# EAGLE design Jetson_TK1 (EAGLE 7.5.0)

## Sheet 1 of 2: Camera Connector The LM340MP-05 converts +5V to +3.3V
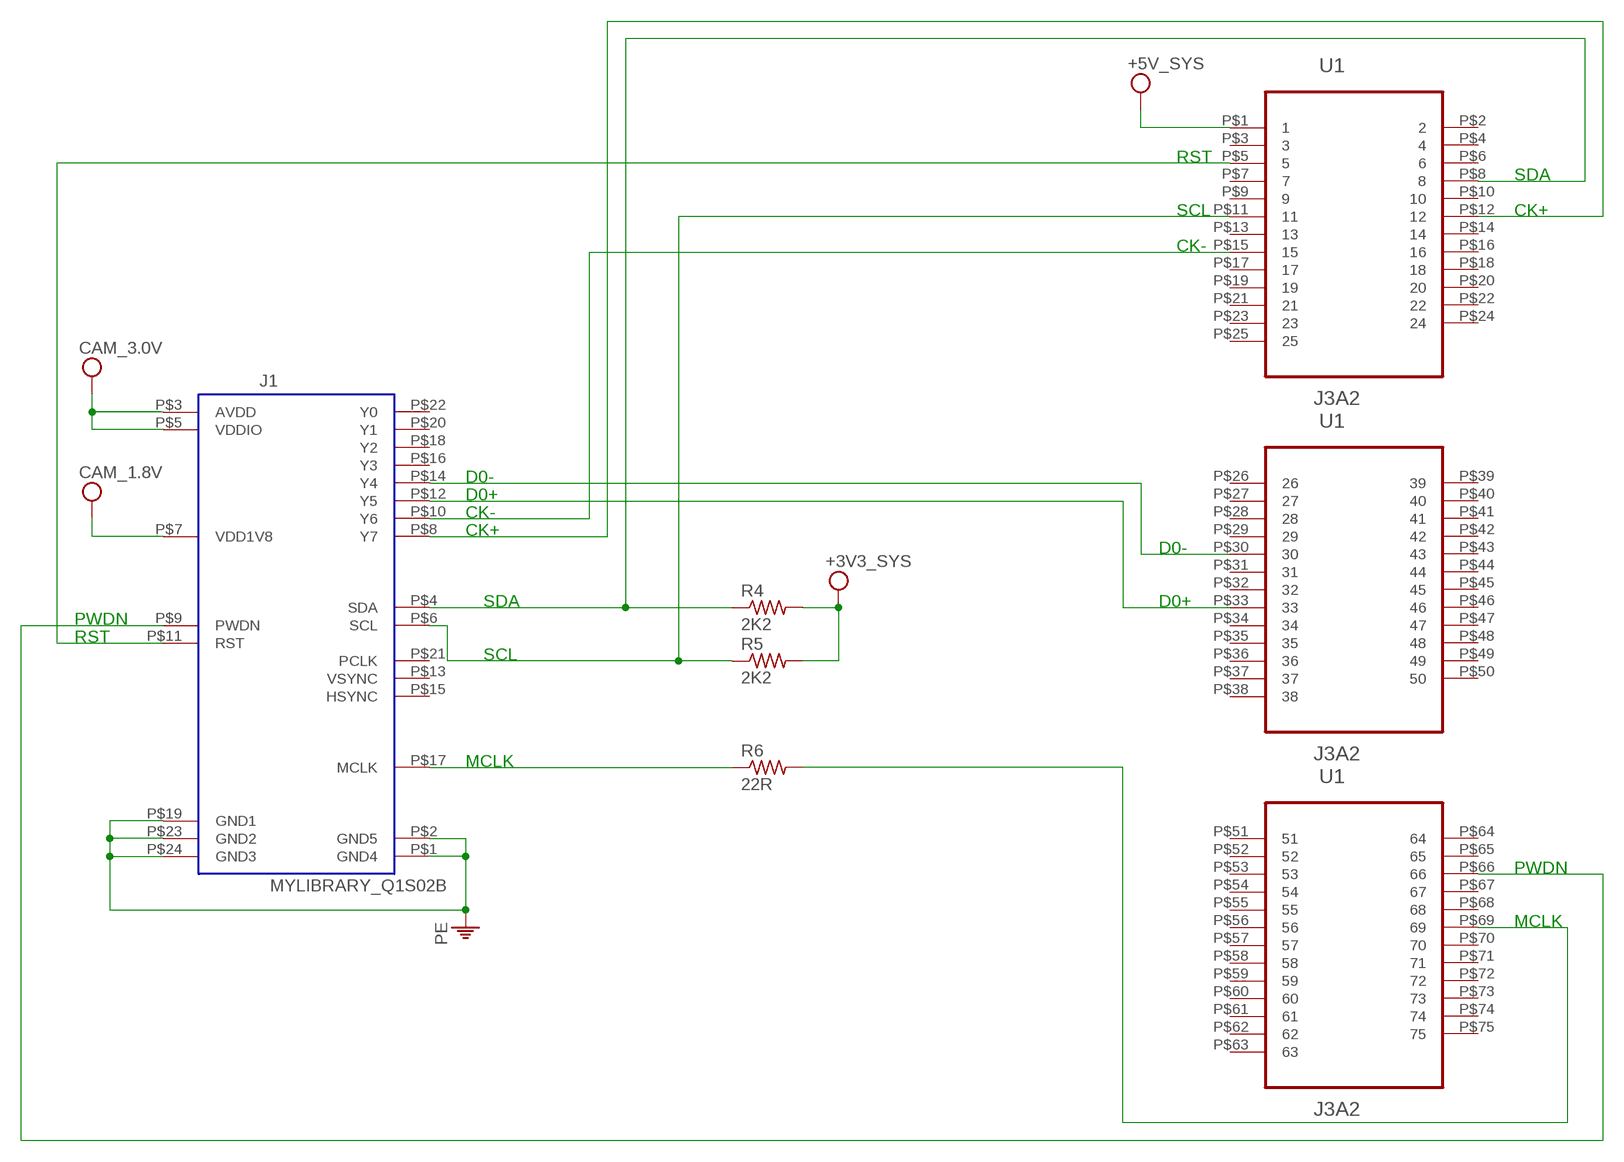
[diagram p0: schematic, sheet 1]

### Parts
J1  MYLIBRARY_Q1S02B  [MYLIBRARY_AXK824145WG]
R4  2K2  R-US_R0603  [R0603]
R5  2K2  R-US_R0603  [R0603]
R6  22R  R-US_R0603  [R0603]
U1  J3A2  [SQW-150-01-F-T]

### Nets
N$3: J1.P$8(Y7) U1.P$12
N$4: J1.P$4(SDA) R4.1 U1.P$8
N$5: J1.P$6(SCL) R5.1 U1.P$11
N$6: J1.P$10(Y6) U1.P$15
N$7: J1.P$12(Y5) U1.P$33
N$8: J1.P$14(Y4) U1.P$30
N$9: J1.P$17(MCLK) R6.1
N$10: R6.2 U1.P$69
N$11: J1.P$11(RST) U1.P$5
N$12: J1.P$9(PWDN) U1.P$66
PE: J1.P$1(GND4) J1.P$2(GND5) J1.P$19(GND1) J1.P$23(GND2) J1.P$24(GND3) ; also sheet 2
VDD: J1.P$3(AVDD) J1.P$5(VDDIO) J1.P$7(VDD1V8) R4.2 R5.2 U1.P$1 ; supply symbol labelled CAM_1.8V, CAM_3.0V, +5V_SYS, +3V3_SYS ; also sheet 2
Unconnected: J1.P$13(VSYNC) J1.P$15(HSYNC) J1.P$16(Y3) J1.P$18(Y2) J1.P$20(Y1) J1.P$21(PCLK) J1.P$22(Y0) U1.P$2 U1.P$3 U1.P$4 U1.P$6 U1.P$7 U1.P$9 U1.P$10 U1.P$13 U1.P$14 U1.P$16 U1.P$17 U1.P$18 U1.P$19 U1.P$20 U1.P$21 U1.P$22 U1.P$23 U1.P$24 U1.P$25 U1.P$26 U1.P$27 U1.P$28 U1.P$29 U1.P$31 U1.P$32 U1.P$34 U1.P$35 U1.P$36 U1.P$37 U1.P$38 U1.P$39 U1.P$40 U1.P$41 U1.P$42 U1.P$43 U1.P$44 U1.P$45 U1.P$46 U1.P$47 U1.P$48 U1.P$49 U1.P$50 U1.P$51 U1.P$52 U1.P$53 U1.P$54 U1.P$55 U1.P$56 U1.P$57 U1.P$58 U1.P$59 U1.P$60 U1.P$61 U1.P$62 U1.P$63 U1.P$64 U1.P$65 U1.P$67 U1.P$68 U1.P$70 U1.P$71 U1.P$72 U1.P$73 U1.P$74 U1.P$75

### Notes on the sheet
- RST
- SDA
- SCL | CK+
- CK-
- D0-
- D0+
- CK-
- CK+
- D0-
- SDA | D0+
- PWDN
- RST
- SCL
- MCLK
- PWDN
- MCLK

## Sheet 2 of 2: Camera Power Supply
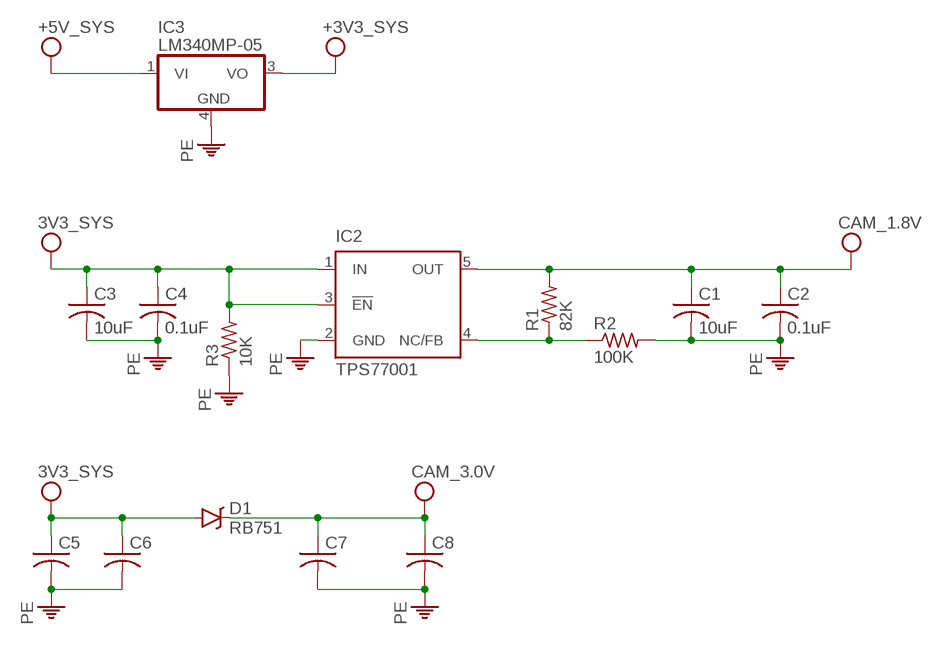
[diagram p1: schematic, sheet 2]

### Parts
C1  10uF  C-USC0603  [C0603]
C2  0.1uF  C-USC0603  [C0603]
C3  10uF  C-USC0603  [C0603]
C4  0.1uF  C-USC0603  [C0603]
C5  C-USC0603  [C0603]
C6  C-USC0603  [C0603]
C7  C-USC0603  [C0603]
C8  C-USC0603  [C0603]
D1  RB751  DIODE-SCHOTTKY-RB751  [SOD-523]
IC2  TPS77001  [SOT23-DBV]
IC3  LM340MP-05  [SOT223]
R1  82K  R-US_R0603  [R0603]
R2  100K  R-US_R0603  [R0603]
R3  10K  R-US_R0603  [R0603]

### Nets
N$2: IC2.4(NC/FB) R1.1 R2.1
PE: C1.2 C2.2 C3.2 C4.2 C5.2 C6.2 C7.2 C8.2 IC2.2(GND) IC3.4(GND) R2.2 R3.1 ; also sheet 1
VCC: C3.1 C4.1 C5.1 C6.1 D1.A IC2.1(IN) IC2.3(!EN) IC3.1(VI) IC3.3(VO) R3.2 ; supply symbol labelled 3V3_SYS, +5V_SYS, +3V3_SYS
VDD: C1.1 C2.1 C7.1 C8.1 D1.C IC2.5(OUT) R1.2 ; supply symbol labelled CAM_1.8V, CAM_3.0V ; also sheet 1

## Library data of the parts
C1-C8 = resistor:C-US: CAPACITOR, American symbol
D1 = SparkFun-DiscreteSemi:DIODE-SCHOTTKY: Schottky diodes in SFE's production catalog BAT20J 1A 23V 0.62Vf RB751 120mA 40V 0.37Vf PMEG4005EJ 0.5A 40V 0.42Vf MBRA140 1A 40V 0.5Vf B340A 3A 40V SMA; PROD_ID: DIO-11018
IC2 = texas:TPS770*: ULTRALOW-POWER 50-mA LOW-DROPOUT LINEAR REGULATORS 50-mA Low-Dropout Regulator Source: http://focus.ti.com/lit/ds/symlink/tps77001.pdf; MF: TEXAS INSTRUMENTS; MPN: TPS77001DBVT; OC_FARNELL: 8461554; OC_NEWARK: 77C1171
IC3 = linear:LM340?-*: Positive VOLTAGE REGULATOR Source: http://cache.national.com/ds/LM/LM340.pdf
J1 = pcDuino3c_MB:MYLIBRARY_Q1S02B
R1-R6 = resistor:R-US_: RESISTOR, American symbol
U1 = SQW-150-01-F-T:J3A2: SQW-150-01-F-T J3A2 Jetson TK1 GPIO Expansion Header 75 Pins - 3 Rows x 25 Pins

## Board
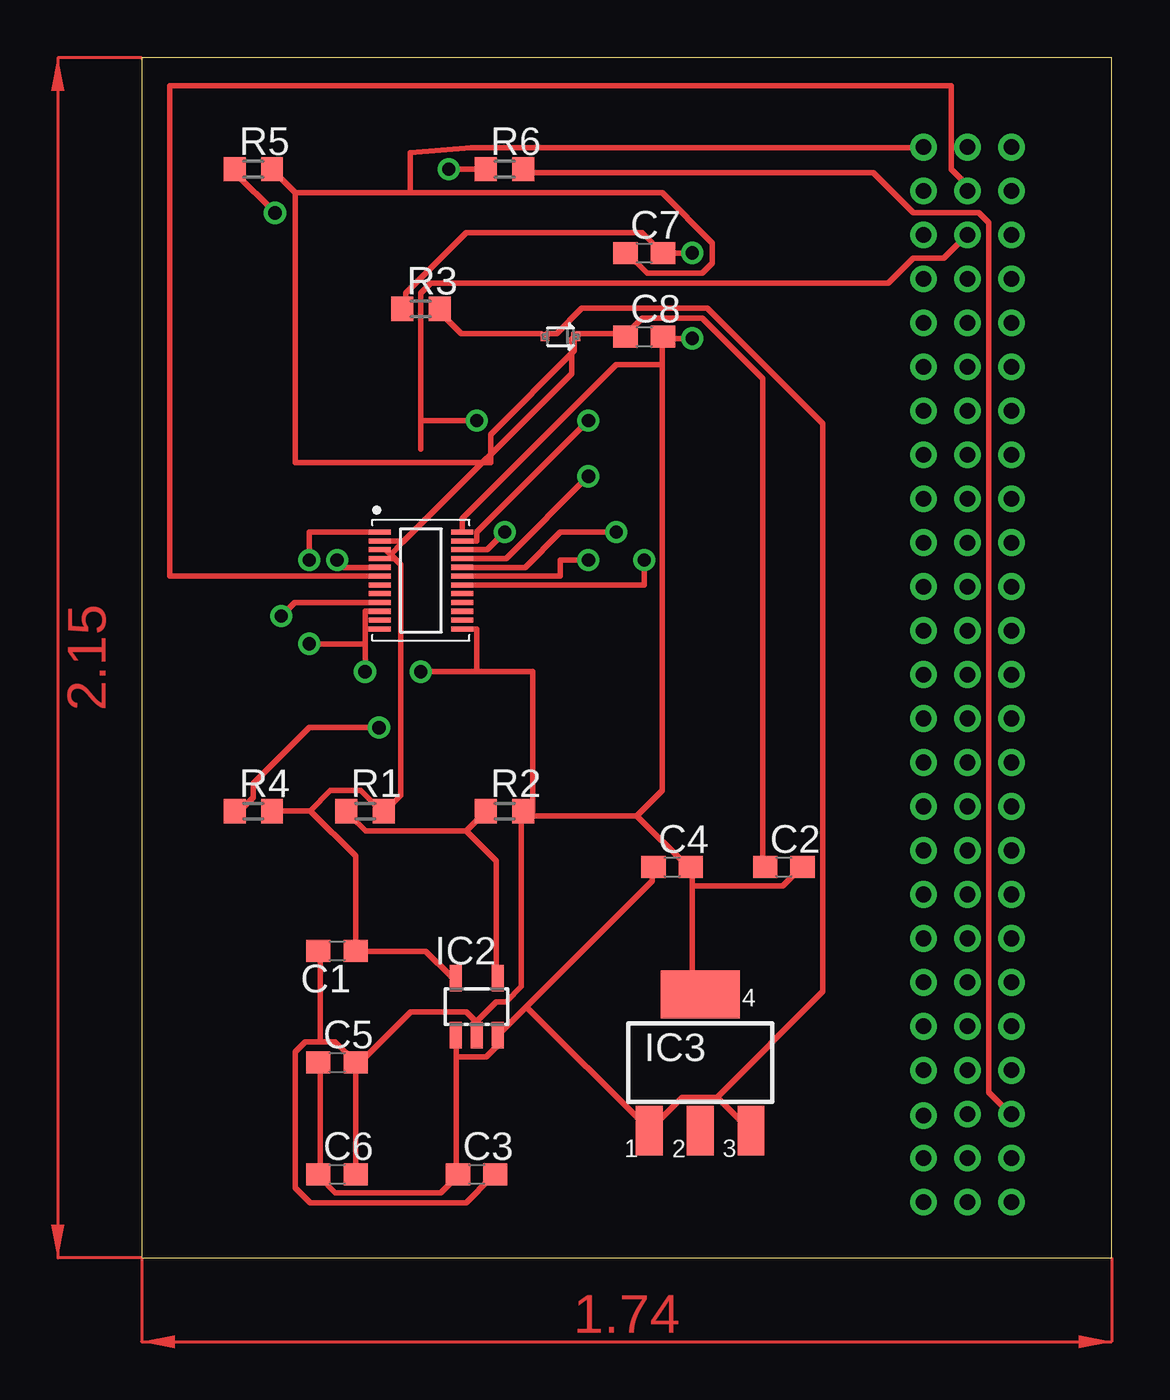
[diagram p2: board, top side]
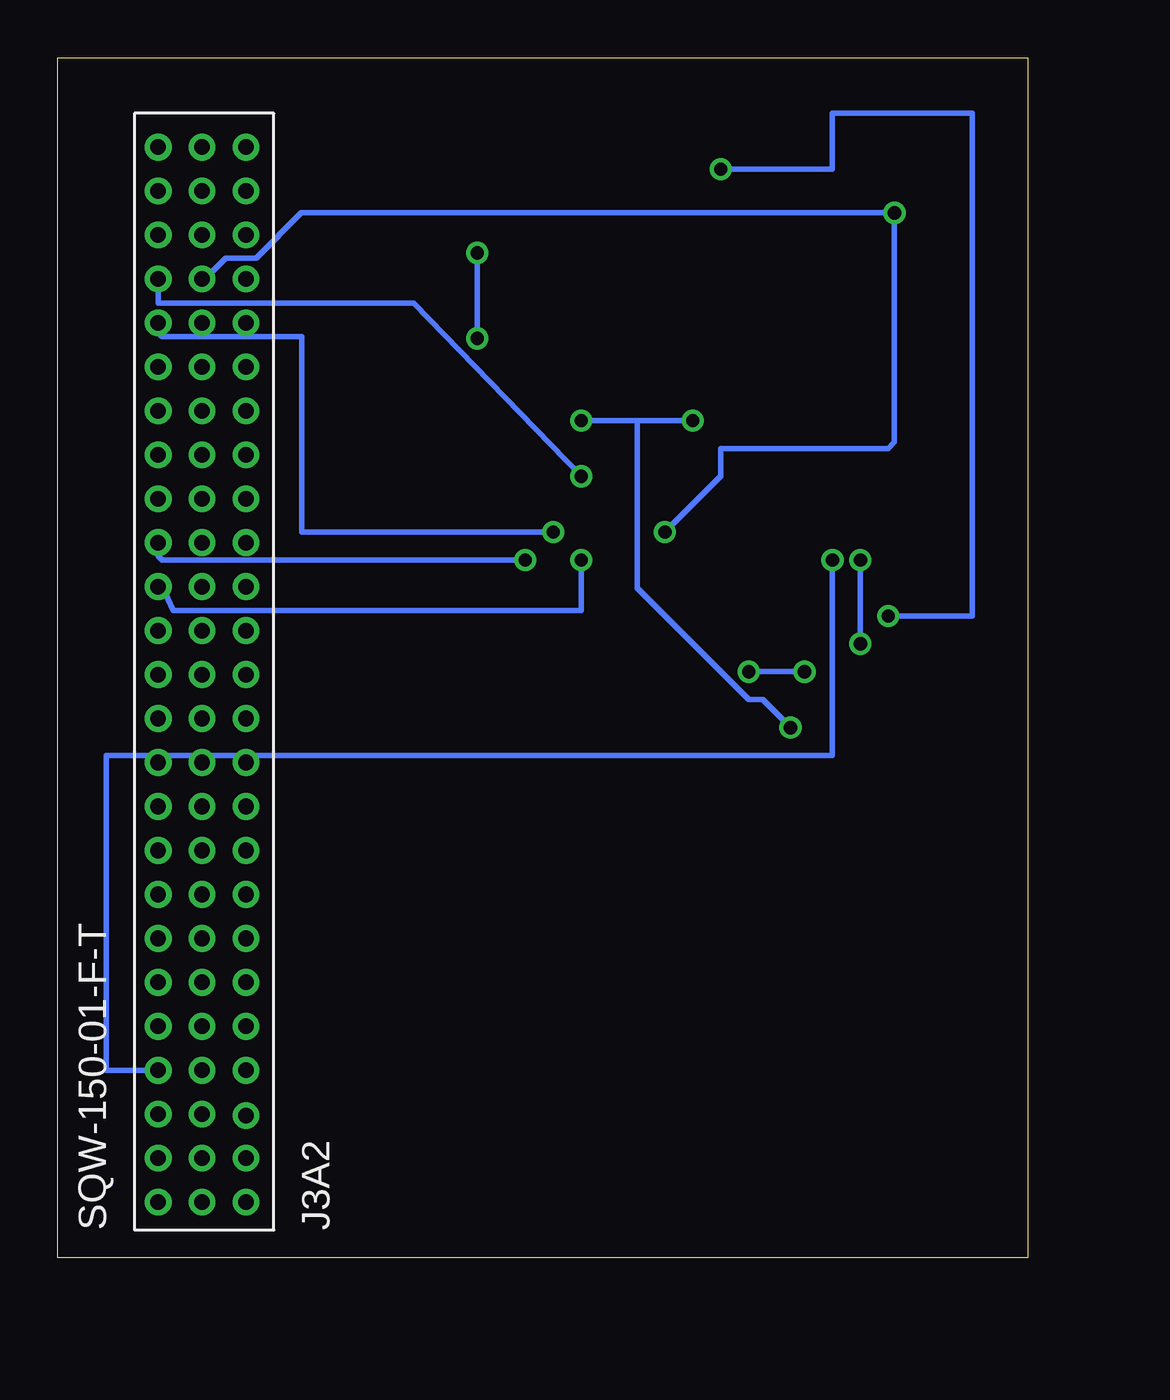
[diagram p3: board, bottom side, seen from below]

Size 44.12 x 54.6 mm. Coordinates in mm from the lower left corner, seen from the top.
Outline: 0,0 44.12,0 44.12,54.6 0,54.6 0,0
Copper layers (1*16): Top 0.035mm / dielectric 1.5mm / Bottom 0.035mm
Design rules "default": minimum track width 10mil, minimum drill 24mil, track to track 8mil, track to pad 8mil, pad to pad 8mil, via to via 8mil, smd to smd 8mil, copper to edge 40mil, drill to drill 8mil, minimum pad ring 10mil, minimum via ring 8mil, stop-mask expansion 4mil, vias tented up to drill 0mil, thermal gap 10mil

### Footprints (pad centres in the part's own frame; a part is rotated, then mirrored left to right if it is on the bottom)
C0603 = smd 1.1 x 1: 1 -0.85,0; 2 0.85,0
SOD-523 = smd 0.4 x 0.4: A -0.7,0; C 0.7,0
SOT23-DBV = smd 0.55 x 1.2: 1 -0.95,-1.3; 2 0,-1.3; 3 0.95,-1.3; 4 0.95,1.3; 5 -0.95,1.3
SOT223 = smd 1.219 x 2.235: 1 -2.311,-3.099; 2 0,-3.099; 3 2.311,-3.099 | smd 3.6 x 2.2: 4 0,3.099
MYLIBRARY_AXK824145WG = smd 0.23 x 1: P$1 0,-1.88; P$2 0,1.88; P$3 0.4,-1.88; P$4 0.4,1.88; P$5 0.8,-1.88; P$6 0.8,1.88; P$7 1.2,-1.88; P$8 1.2,1.88; P$9 1.6,-1.88; P$10 1.6,1.88; P$11 2,-1.88; P$12 2,1.88; P$13 2.4,-1.88; P$14 2.4,1.88; P$15 2.8,-1.88; P$16 2.8,1.88; P$17 3.2,-1.88; P$18 3.2,1.88; P$19 3.6,-1.88; P$20 3.6,1.88; P$21 4,-1.88; P$22 4,1.88; P$23 4.4,-1.88; P$24 4.4,1.88
R0603 = smd 1 x 1.1: 1 -0.85,0; 2 0.85,0
SQW-150-01-F-T = drill 0.711: P$1 48,0; P$2 48,2; P$3 48,4; P$4 46,0; P$5 46,2; P$6 46,4; P$7 44,0; P$8 44,2; P$9 44,4; P$10 42,0; P$11 42,2; P$12 42,4; P$13 40,0; P$14 40,2; P$15 40,4; P$16 38,0; P$17 38,2; P$18 38,4; P$19 36,0; P$20 36,2; P$21 36,4; P$22 34,0; P$23 34,2; P$24 34,4; P$25 32,0; P$26 32,2; P$27 32,4; P$28 30,0; P$29 30,2; P$30 30,4; P$31 28,0; P$32 28,2; P$33 28,4; P$34 26,0; P$35 26,2; P$36 26,4; P$37 24,0; P$38 24,2; P$39 24,4; P$40 22,0; P$41 22,2; P$42 22,4; P$43 20,0; P$44 20,2; P$45 20,4; P$46 18,0; P$47 18,2; P$48 18,4; P$49 16,0; P$50 16,2; P$51 16,4; P$52 14,0; P$53 14,2; P$54 14,4; P$55 12,0; P$56 12,2; P$57 12,4; P$58 10,0; P$59 10,2; P$60 10,4; P$61 8,0; P$62 8,2; P$63 8,4; P$64 5.999,0; P$65 6,2; P$66 6,4; P$67 3.932,0; P$68 4,2; P$69 4,4; P$70 2,0; P$71 2,2; P$72 2,4; P$73 0,0; P$74 0,2; P$75 0,4

### Placement (x,y rotation side)
C1  8.89,13.97 180 top
C2  29.21,17.78 0 top
C3  15.24,3.81 0 top
C4  24.13,17.78 0 top
C5  8.89,8.89 0 top
C6  8.89,3.81 0 top
C7  22.86,45.72 0 top
C8  22.86,41.91 0 top
D1  19.05,41.91 0 top
IC2  15.24,11.43 0 top
IC3  25.4,8.89 0 top
J1  12.7,33.02 270 top
R1  10.16,20.32 0 top
R2  16.51,20.32 0 top
R3  12.7,43.18 0 top
R4  5.08,20.32 0 top
R5  5.08,49.53 0 top
R6  16.51,49.53 0 top
U1  35.56,2.54 90 bottom

### Tracks (layer width: path | path; a pad name or v marks a point on that pad's centre or on a via)
N$2
  Top 0.254: 14.76,19.43 10.18,19.43 9.5,20.12 R1.1 | 14.76,19.43 15.44,20.12 R2.1 | 14.76,19.43 16.13,18.06 16.13,12.8 IC2.4
N$3  (via drill 0.6)
  Top 0.254: J1.P$8 16.58,31.82 v20.32,35.56
  Bottom 0.254: U1.P$12 39.56,43.43 27.94,43.43 v20.32,35.56
N$4  (via drill 0.6, 0.61)
  Top 0.254: 12.7,38.1 12.7,43.89 13.16,44.35 33.96,44.35 35.1,45.49 36.47,45.49 37.39,46.41 U1.P$8 | 12.7,38.1 12.7,36.8 | 4.24,20.34 R4.1 4.45,20.32 5.08,20.95 5.08,21.59 7.62,24.13 v10.79,24.13 | J1.P$4 15.24,32.62 15.24,33.02 v20.32,38.1 | 12.7,38.1 v15.24,38.1
  Bottom 0.254: v20.32,38.1 17.78,38.1 | 17.78,38.1 v15.24,38.1 | v10.79,24.13 12.06,25.4 12.7,25.4 17.78,30.48 17.78,38.1
N$5  (via drill 0.6, 0.61)
  Top 0.254: v6.07,47.55 4.24,49.38 R5.1 | J1.P$6 15.71,32.22 v16.51,33.02
  Bottom 0.254: U1.P$11 37.39,44.58 36.47,45.49 35.1,45.49 33.04,47.55 v6.07,47.55 6.07,37.11 6.35,36.83 13.97,36.83 13.97,35.56 v16.51,33.02
N$6  (via drill 0.6)
  Top 0.254: J1.P$10 17.45,31.42 19.05,33.02 v21.59,33.02
  Bottom 0.254: U1.P$15 39.56,42.1 39.37,41.91 33.02,41.91 33.02,33.02 v21.59,33.02
N$7  (via drill 0.6)
  Top 0.254: J1.P$12 19.05,31.02 19.05,31.75 v20.32,31.75
  Bottom 0.254: U1.P$33 39.37,30.54 38.86,29.46 20.32,29.46 v20.32,31.75
N$8  (via drill 0.6)
  Top 0.254: J1.P$14 22.86,30.62 v22.86,31.75
  Bottom 0.254: U1.P$30 39.56,31.94 39.37,31.75 v22.86,31.75
N$9  (via drill 0.6)
  Top 0.254: R6.1 v13.97,49.53 | J1.P$17 6.96,29.82 v6.35,29.21
  Bottom 0.254: v13.97,49.53 8.89,49.53 8.89,52.07 2.54,52.07 2.54,29.21 v6.35,29.21
N$10
  Top 0.254: R6.2 17.5,49.38 33.27,49.38 35.1,47.55 38.07,47.55 38.53,47.09 38.53,7.54 39.45,6.63 U1.P$69
N$11
  Top 0.254: U1.P$5 37.56,48.8 36.83,49.53 36.83,53.34 1.27,53.34 1.27,31.02 J1.P$11
N$12  (via drill 0.6)
  Top 0.254: J1.P$9 9.22,31.42 v8.89,31.75
  Bottom 0.254: U1.P$66 41.91,8.54 41.91,22.86 8.89,22.86 v8.89,31.75
PE  (via drill 0.6, 0.61)
  Top 0.254: C6.2 9.73,3.89 9.73,8.69 C5.2 | 8.13,9.83 8.81,9.83 9.73,8.91 C5.2 | 8.13,9.83 7.44,9.83 6.98,9.37 6.98,3.2 7.67,2.52 14.76,2.52 15.9,3.66 C3.2 | 8.13,9.83 8.13,13.95 C1.2 | 15.21,10.74 15.21,10.29 IC2.2 | 15.21,10.74 14.76,11.2 12.24,11.2 9.96,8.91 C5.2 | R3.1 12.01,43.2 12.01,43.89 14.76,46.63 22.76,46.63 23.67,45.72 C7.2 v25.04,45.72 | 25.04,16.92 25.04,12.34 25.27,12.12 IC3.4 | 25.04,16.92 25.04,17.6 C4.2 24.82,17.83 22.53,20.12 | 22.53,20.12 17.5,20.12 R2.2 | 25.04,16.92 29.16,16.92 29.84,17.6 C2.2 | 23.67,40.64 23.67,21.26 22.53,20.12 | 23.67,40.64 23.67,41.83 C8.2 23.9,41.83 v25.04,41.83 | 15.21,10.74 16.13,11.66 16.59,11.66 17.27,12.34 17.27,20.12 R2.2 | 10.16,28.62 10.16,29.42 J1.P$19 | J1.P$24 15.24,28.62 15.24,26.67 | 15.24,26.67 v12.7,26.67 | J1.P$23 10.16,28.62 | 10.16,28.62 10.16,27.94 | 10.16,27.94 v10.16,26.67 | R2.2 17.78,20.32 17.78,26.67 15.24,26.67 | J1.P$2 14.58,33.63 21.59,40.64 23.67,40.64 | 10.16,33.02 J1.P$1 7.62,33.02 v7.62,31.75 | v7.62,27.94 10.16,27.94
  Bottom 0.254: v25.04,41.83 v25.04,45.72 | v12.7,26.67 v10.16,26.67 | v7.62,31.75 v7.62,27.94
VCC
  Top 0.254: C5.1 8.13,8.69 8.13,3.89 C6.1 8.13,3.66 8.81,2.97 13.61,2.97 14.3,3.66 C3.1 14.3,3.89 14.3,9.14 | 14.3,9.14 14.3,10.06 IC2.1 | 17.5,11.43 16.36,10.29 IC2.3 16.13,10.06 16.13,9.6 15.67,9.14 14.3,9.14 | 17.5,11.43 23.22,17.14 23.22,17.6 C4.1 | R3.2 13.61,42.98 14.53,42.06 18.19,42.06 D1.A 18.41,42.06 18.87,42.06 20.01,43.2 25.73,43.2 30.99,37.95 30.99,12.12 26.19,7.32 | 26.19,7.32 24.59,7.32 23.22,5.94 IC3.1 22.99,5.94 17.5,11.43 | IC3.3 26.19,7.32
VDD
  Top 0.254: 6.98,48.46 12.22,48.46 | 12.22,48.46 23.67,48.46 25.96,46.18 25.96,45.26 25.5,44.81 22.99,44.81 22.07,45.72 C7.1 | 6.98,48.46 6.07,49.38 R5.2 | 12.22,48.46 12.22,50.29 14.99,50.52 35.56,50.52 U1.P$1 | IC2.5 14.07,12.8 12.93,13.95 9.96,13.95 C1.1 9.73,14.17 9.73,18.29 7.67,20.34 | 11.51,31.83 11.79,31.55 11.79,21.03 11.1,20.34 R1.2 10.87,20.34 9.96,21.26 8.59,21.26 7.67,20.34 | 11.51,31.83 11.33,32 | 11.33,32 11.1,32.23 10.87,32.23 J1.P$5 | 7.67,20.34 6.07,20.34 R4.2 5.84,20.12 | D1.C 19.79,42.06 21.84,42.06 C8.1 22.07,42.06 22.76,42.75 25.5,42.75 28.24,40.01 28.24,17.83 C2.1 | 11.89,32.56 19.56,40.23 19.56,41.83 D1.C | 11.89,32.56 11.33,32 | 6.98,48.46 6.98,36.2 15.87,36.2 15.87,37.47 19.68,41.27 19.68,41.91 D1.C | J1.P$3 11.83,32.62 11.89,32.56 | J1.P$7 11.51,31.82 11.51,31.83
(copper drawn outside any net)
  shapes: Top area x2